# EAGLE design HRD_2016 (EAGLE 7.3.0)

## Sheet 1 of 3
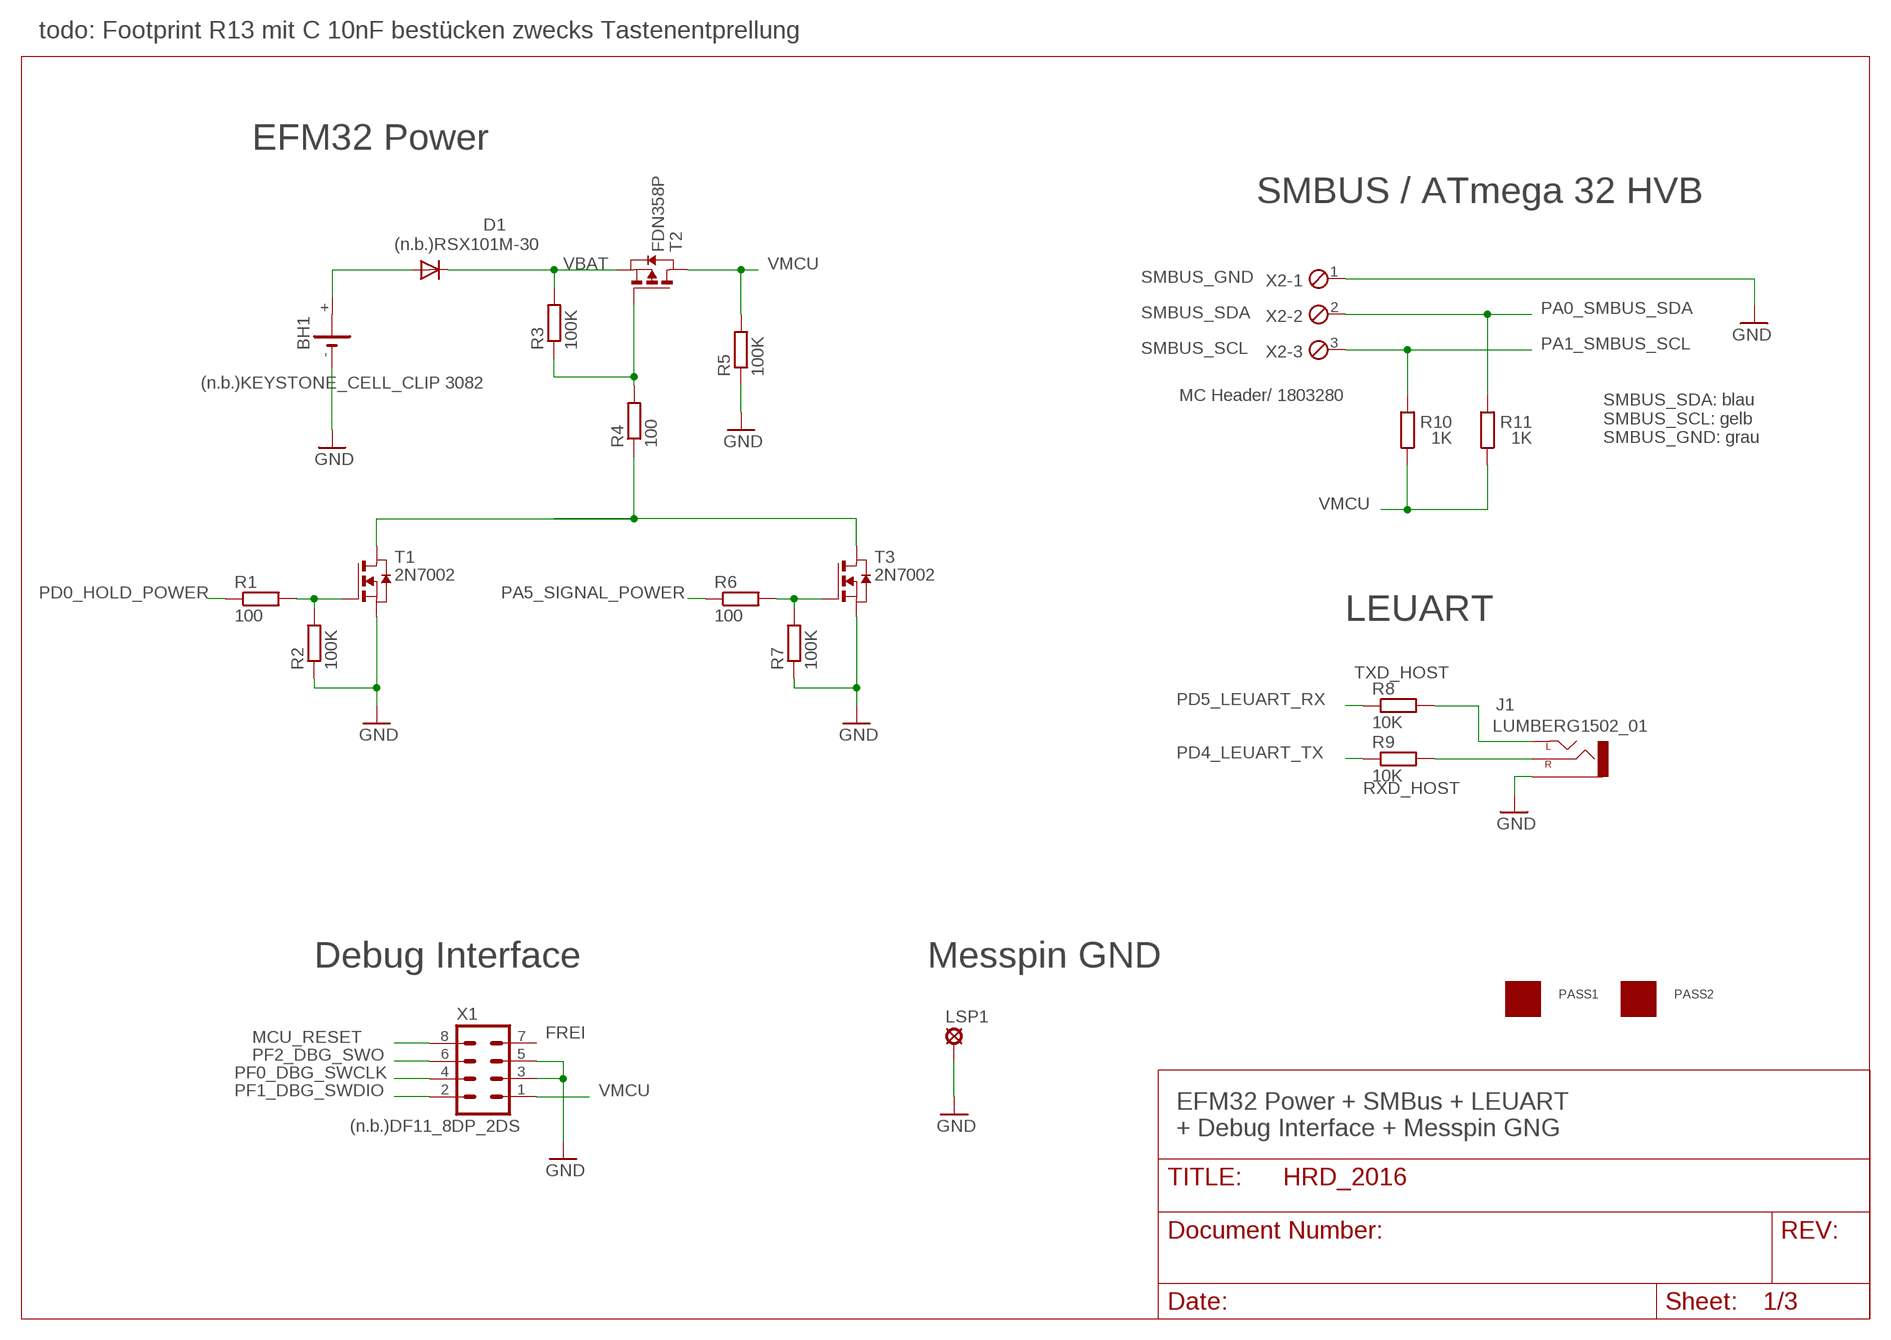
[diagram p0: schematic, sheet 1]

### Parts
BH1  (n.b.)KEYSTONE_CELL_CLIP 3082  3082  [3082]
D1  (n.b.)RSX101M-30  DIODE-SOD123  [SOD123]
J1  LUMBERG1502_01  [LUMBERG1502_01]
LSP1  (n.b.)LSP13  LSP13  [LSP13]
PASS1  ROUND_1MM1.5  [ROUND2_1.5MM]
PASS2  ROUND_1MM1.5  [ROUND2_1.5MM]
R1  100  R-EU_R0805  [R0805]
R2  100K  R-EU_R0805  [R0805]
R3  100K  R-EU_R0805  [R0805]
R4  100  R-EU_R0805  [R0805]
R5  100K  R-EU_R0805  [R0805]
R6  100  R-EU_R0805  [R0805]
R7  100K  R-EU_R0805  [R0805]
R8  10K  R-EU_R0805  [R0805]
R9  10K  R-EU_R0805  [R0805]
R10  1K  R-EU_R0805  [R0805]
R11  1K  R-EU_R0805  [R0805]
T1  2N7002  NMOSSOT23  [SOT-23]
T2  FDN358P  ZETEX_PMOSSOT23  [ZETEX_SOT-23]
T3  2N7002  NMOSSOT23  [SOT-23]
X1  (n.b.)DF11_8DP_2DS  DP11_8DP_2DS  [DP11_8DP-2DS]
X2  MC Header/ 1803280  MKDS1/3-3,81  [3POL381]

### Nets
GND: BH1.- J1.P$1(1-SLEEVE) LSP1.MP R2.1 R5.1 R7.1 T1.2(S) T3.2(S) X1.3 X1.5 X2.1 ; also sheet 2,3
MCU_RESET: X1.8 ; also sheet 2
N$1: BH1.+ D1.A
N$5: R1.2 R2.2 T1.3(G)
N$7: R4.1 T1.1(D) T3.1(D)
N$8: R6.2 R7.2 T3.3(G)
N$21: R3.1 R4.2 T2.3(G)
PA0_SMBUS_SDA: R11.2 X2.2 ; also sheet 2
PA1_SMBUS_SCL: R10.2 X2.3 ; also sheet 2
PA5_SIGNAL_POWER: R6.1 ; also sheet 2,3
PD0_HOLD_POWER: R1.1 ; also sheet 2
PD4_LEUART_TX: R9.1 ; also sheet 2
PD5_LEUART_RX: R8.1 ; also sheet 2
PF0_DBG_SWCLK: X1.4 ; also sheet 2
PF1_DBG_SWDIO: X1.2 ; also sheet 2
PF2_DBG_SWO: X1.6 ; also sheet 2
RXD_HOST: J1.P$3(3-RIGHT) R9.2
TXD_HOST: J1.P$2(2-LEFT) R8.2
VBAT: D1.C R3.2 T2.2(S) ; also sheet 3
VMCU: R5.2 R10.1 R11.1 T2.1(D) X1.1 ; also sheet 2,3
Unconnected: BH1.+1(+) X1.7

### Notes on the sheet
- todo: Footprint R13 mit C 10nF bestücken zwecks Tastenentprellung
- EFM32 Power
- SMBUS / ATmega 32 HVB
- SMBUS_GND
- SMBUS_SDA
- SMBUS_SCL
- SMBUS_SDA: blau
  SMBUS_SCL: gelb
  SMBUS_GND: grau
- LEUART
- Debug Interface | Messpin GND
- FREI
- EFM32 Power + SMBus + LEUART
  + Debug Interface + Messpin GNG

## Sheet 2 of 3
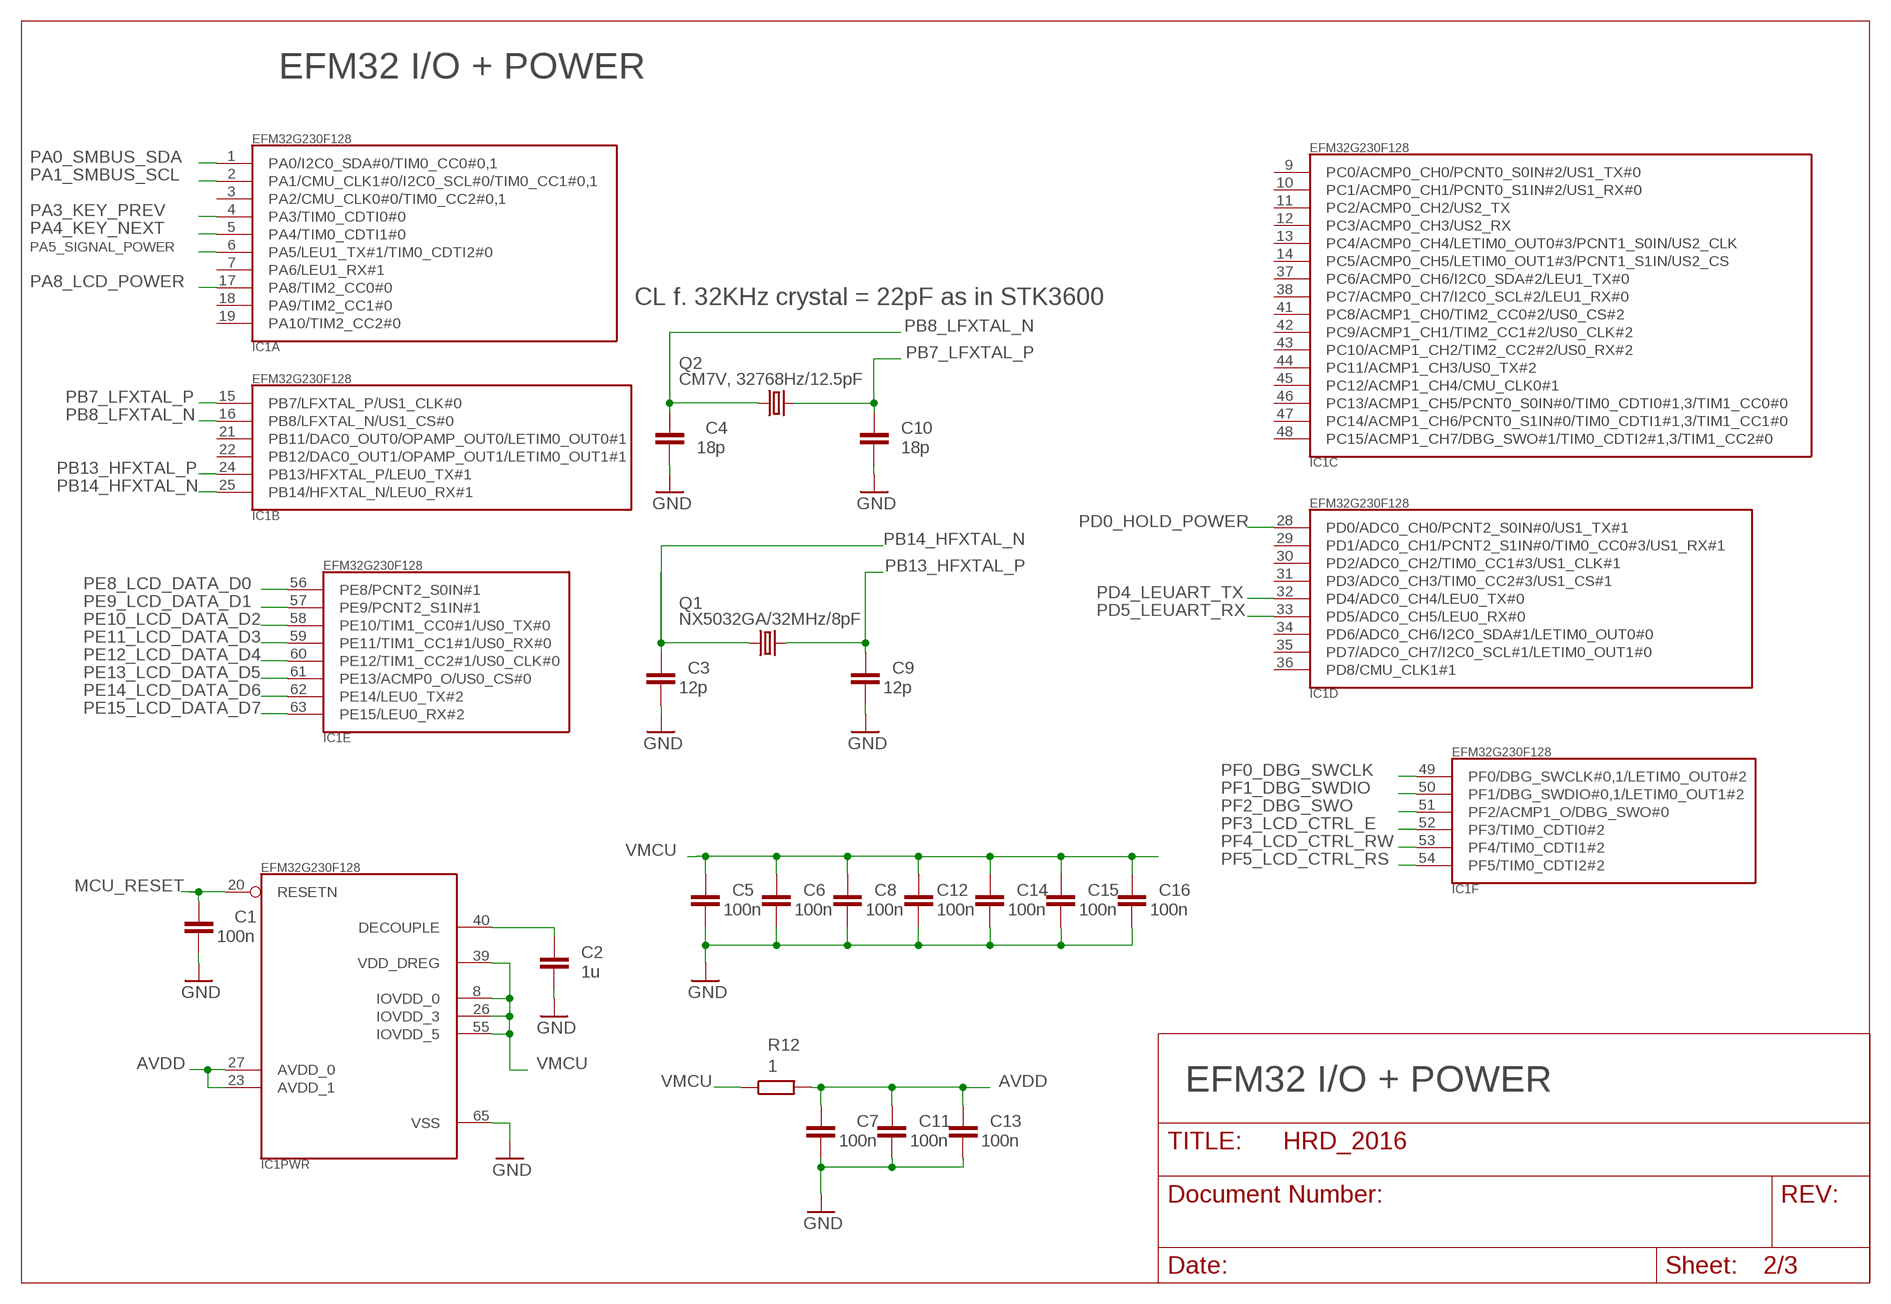
[diagram p1: schematic, sheet 2]

### Parts
C1  100n  C-EUC0805K  [C0805K]
C2  1u  C-EUC0805K  [C0805K]
C3  12p  C-EUC0805K  [C0805K]
C4  18p  C-EUC0805K  [C0805K]
C5  100n  C-EUC0805K  [C0805K]
C6  100n  C-EUC0805K  [C0805K]
C7  100n  C-EUC0805K  [C0805K]
C8  100n  C-EUC0805K  [C0805K]
C9  12p  C-EUC0805K  [C0805K]
C10  18p  C-EUC0805K  [C0805K]
C11  100n  C-EUC0805K  [C0805K]
C12  100n  C-EUC0805K  [C0805K]
C13  100n  C-EUC0805K  [C0805K]
C14  100n  C-EUC0805K  [C0805K]
C15  100n  C-EUC0805K  [C0805K]
C16  100n  C-EUC0805K  [C0805K]
IC1  EFM32G230F128  [QFN64]
Q1  NX5032GA/32MHz/8pF  CRYSTAL2P5.0X3.2  [CRYSTAL2P5.0X3.2]
Q2  CM7V, 32768Hz/12.5pF  CRYSTAL2P  [CRYSTAL2P3.2X1.5]
R12  1  R-EU_R0805  [R0805]

### Nets
AVDD [VCC]: C7.2 C11.2 C13.2 IC1.23(PWR:AVDD_1) IC1.27(PWR:AVDD_0) R12.2
GND: C1.1 C2.1 C3.1 C4.1 C5.1 C6.1 C7.1 C8.1 C9.1 C10.1 C11.1 C12.1 C13.1 C14.1 C15.1 C16.1 IC1.65(PWR:VSS) ; also sheet 1,3
MCU_RESET: C1.2 IC1.20(PWR:RESETN) ; also sheet 1
N$30: C2.2 IC1.40(PWR:DECOUPLE)
PA0_SMBUS_SDA: IC1.1(A:PA0/I2C0_SDA#0/TIM0_CC0#0,1) ; also sheet 1
PA1_SMBUS_SCL: IC1.2(A:PA1/CMU_CLK1#0/I2C0_SCL#0/TIM0_CC1#0,1) ; also sheet 1
PA3_KEY_PREV: IC1.4(A:PA3/TIM0_CDTI0#0) ; also sheet 3
PA4_KEY_NEXT: IC1.5(A:PA4/TIM0_CDTI1#0) ; also sheet 3
PA5_SIGNAL_POWER: IC1.6(A:PA5/LEU1_TX#1/TIM0_CDTI2#0) ; also sheet 1,3
PA8_LCD_POWER: IC1.17(A:PA8/TIM2_CC0#0) ; also sheet 3
PB7_LFXTAL_P: C10.2 IC1.15(B:PB7/LFXTAL_P/US1_CLK#0) Q2.2
PB8_LFXTAL_N: C4.2 IC1.16(B:PB8/LFXTAL_N/US1_CS#0) Q2.1
PB13_HFXTAL_P: C9.2 IC1.24(B:PB13/HFXTAL_P/LEU0_TX#1) Q1.2
PB14_HFXTAL_N: C3.2 IC1.25(B:PB14/HFXTAL_N/LEU0_RX#1) Q1.1
PD0_HOLD_POWER: IC1.28(D:PD0/ADC0_CH0/PCNT2_S0IN#0/US1_TX#1) ; also sheet 1
PD4_LEUART_TX: IC1.32(D:PD4/ADC0_CH4/LEU0_TX#0) ; also sheet 1
PD5_LEUART_RX: IC1.33(D:PD5/ADC0_CH5/LEU0_RX#0) ; also sheet 1
PE8_LCD_DATA_D0: IC1.56(E:PE8/PCNT2_S0IN#1) ; also sheet 3
PE9_LCD_DATA_D1: IC1.57(E:PE9/PCNT2_S1IN#1) ; also sheet 3
PE10_LCD_DATA_D2: IC1.58(E:PE10/TIM1_CC0#1/US0_TX#0) ; also sheet 3
PE11_LCD_DATA_D3: IC1.59(E:PE11/TIM1_CC1#1/US0_RX#0) ; also sheet 3
PE12_LCD_DATA_D4: IC1.60(E:PE12/TIM1_CC2#1/US0_CLK#0) ; also sheet 3
PE13_LCD_DATA_D5: IC1.61(E:PE13/ACMP0_O/US0_CS#0) ; also sheet 3
PE14_LCD_DATA_D6: IC1.62(E:PE14/LEU0_TX#2) ; also sheet 3
PE15_LCD_DATA_D7: IC1.63(E:PE15/LEU0_RX#2) ; also sheet 3
PF0_DBG_SWCLK: IC1.49(F:PF0/DBG_SWCLK#0,1/LETIM0_OUT0#2) ; also sheet 1
PF1_DBG_SWDIO: IC1.50(F:PF1/DBG_SWDIO#0,1/LETIM0_OUT1#2) ; also sheet 1
PF2_DBG_SWO: IC1.51(F:PF2/ACMP1_O/DBG_SWO#0) ; also sheet 1
PF3_LCD_CTRL_E: IC1.52(F:PF3/TIM0_CDTI0#2) ; also sheet 3
PF4_LCD_CTRL_RW: IC1.53(F:PF4/TIM0_CDTI1#2) ; also sheet 3
PF5_LCD_CTRL_RS: IC1.54(F:PF5/TIM0_CDTI2#2) ; also sheet 3
VMCU: C5.2 C6.2 C8.2 C12.2 C14.2 C15.2 C16.2 IC1.8(PWR:IOVDD_0) IC1.26(PWR:IOVDD_3) IC1.39(PWR:VDD_DREG) IC1.55(PWR:IOVDD_5) R12.1 ; also sheet 1,3
Unconnected: IC1.3(A:PA2/CMU_CLK0#0/TIM0_CC2#0,1) IC1.7(A:PA6/LEU1_RX#1) IC1.9(C:PC0/ACMP0_CH0/PCNT0_S0IN#2/US1_TX#0) IC1.10(C:PC1/ACMP0_CH1/PCNT0_S1IN#2/US1_RX#0) IC1.11(C:PC2/ACMP0_CH2/US2_TX) IC1.12(C:PC3/ACMP0_CH3/US2_RX) IC1.13(C:PC4/ACMP0_CH4/LETIM0_OUT0#3/PCNT1_S0IN/US2_CLK) IC1.14(C:PC5/ACMP0_CH5/LETIM0_OUT1#3/PCNT1_S1IN/US2_CS) IC1.18(A:PA9/TIM2_CC1#0) IC1.19(A:PA10/TIM2_CC2#0) IC1.21(B:PB11/DAC0_OUT0/OPAMP_OUT0/LETIM0_OUT0#1) IC1.22(B:PB12/DAC0_OUT1/OPAMP_OUT1/LETIM0_OUT1#1) IC1.29(D:PD1/ADC0_CH1/PCNT2_S1IN#0/TIM0_CC0#3/US1_RX#1) IC1.30(D:PD2/ADC0_CH2/TIM0_CC1#3/US1_CLK#1) IC1.31(D:PD3/ADC0_CH3/TIM0_CC2#3/US1_CS#1) IC1.34(D:PD6/ADC0_CH6/I2C0_SDA#1/LETIM0_OUT0#0) IC1.35(D:PD7/ADC0_CH7/I2C0_SCL#1/LETIM0_OUT1#0) IC1.36(D:PD8/CMU_CLK1#1) IC1.37(C:PC6/ACMP0_CH6/I2C0_SDA#2/LEU1_TX#0) IC1.38(C:PC7/ACMP0_CH7/I2C0_SCL#2/LEU1_RX#0) IC1.41(C:PC8/ACMP1_CH0/TIM2_CC0#2/US0_CS#2) IC1.42(C:PC9/ACMP1_CH1/TIM2_CC1#2/US0_CLK#2) IC1.43(C:PC10/ACMP1_CH2/TIM2_CC2#2/US0_RX#2) IC1.44(C:PC11/ACMP1_CH3/US0_TX#2) IC1.45(C:PC12/ACMP1_CH4/CMU_CLK0#1) IC1.46(C:PC13/ACMP1_CH5/PCNT0_S0IN#0/TIM0_CDTI0#1,3/TIM1_CC0#0) IC1.47(C:PC14/ACMP1_CH6/PCNT0_S1IN#0/TIM0_CDTI1#1,3/TIM1_CC1#0) IC1.48(C:PC15/ACMP1_CH7/DBG_SWO#1/TIM0_CDTI2#1,3/TIM1_CC2#0)

### Notes on the sheet
- EFM32 I/O + POWER
- CL f. 32KHz crystal = 22pF as in STK3600
- EFM32 I/O + POWER

## Sheet 3 of 3
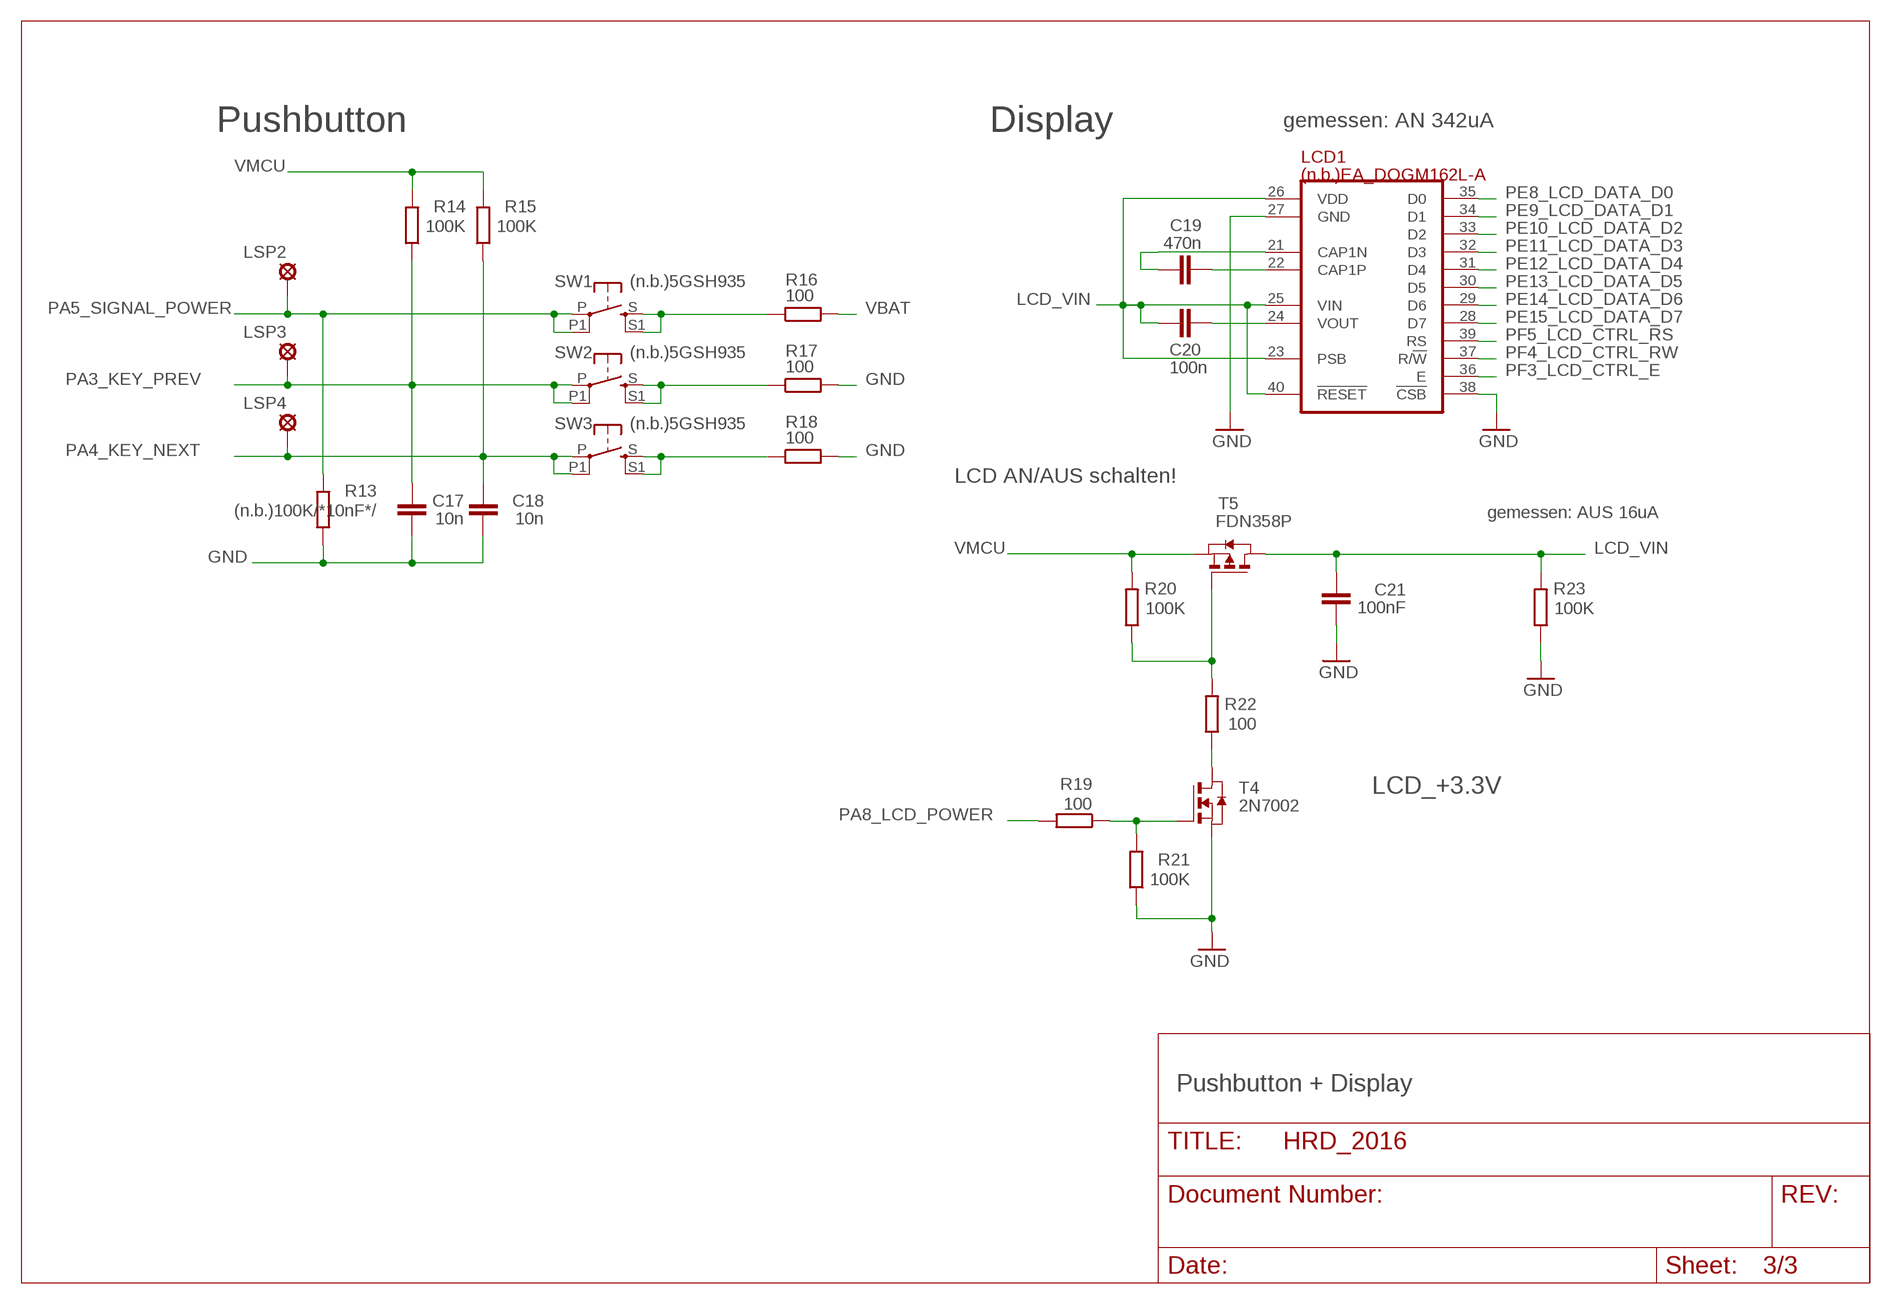
[diagram p2: schematic, sheet 3]

### Parts
C17  10n  C-EUC0603K  [C0603K]
C18  10n  C-EUC0603K  [C0603K]
C19  470n  C-EUC0603K  [C0603K]
C20  100n  C-EUC0603K  [C0603K]
C21  100nF  C-EUC0603K  [C0603K]
LCD1  (n.b.)EA_DOGM162L-A  EA_DOGM162  [EA_DOGM]
LSP2  (n.b.)SE13  SE13  [SE13]
LSP3  (n.b.)SE13  SE13  [SE13]
LSP4  (n.b.)SE13  SE13  [SE13]
R13  (n.b.)100K/*10nF*/  R-EU_R0805  [R0805]
R14  100K  R-EU_R0805  [R0805]
R15  100K  R-EU_R0805  [R0805]
R16  100  R-EU_R0805  [R0805]
R17  100  R-EU_R0805  [R0805]
R18  100  R-EU_R0805  [R0805]
R19  100  R-EU_R0805  [R0805]
R20  100K  R-EU_R0805  [R0805]
R21  100K  R-EU_R0805  [R0805]
R22  100  R-EU_R0805  [R0805]
R23  100K  R-EU_R0805  [R0805]
SW1  (n.b.)5GSH935  5GSH935  [MULTIMEC_5GSH935]
SW2  (n.b.)5GSH935  5GSH935  [MULTIMEC_5GSH935]
SW3  (n.b.)5GSH935  5GSH935  [MULTIMEC_5GSH935]
T4  2N7002  ZETEX_NMOSSOT23  [ZETEX_SOT-23]
T5  FDN358P  ZETEX_PMOSSOT23  [ZETEX_SOT-23]

### Nets
GND: C17.1 C18.1 C21.2 LCD1.27(GND) LCD1.38(!CSB!) R13.1 R17.2 R18.2 R21.1 R23.1 T4.2(S) ; also sheet 1,2
LCD_VIN: C20.2 C21.1 LCD1.23(PSB) LCD1.25(VIN) LCD1.26(VDD) LCD1.40(!RESET!) R23.2 T5.1(D)
N$2: R17.1 SW2.S SW2.S1
N$3: R16.1 SW1.S SW1.S1
N$4: R18.1 SW3.S SW3.S1
N$6: R20.1 R22.2 T5.3(G)
N$10: R22.1 T4.1(D)
N$12: R19.1 R21.2 T4.3(G)
N$25: C19.2 LCD1.22(CAP1P)
N$27: C19.1 LCD1.21(CAP1N)
N$28: C20.1 LCD1.24(VOUT)
PA3_KEY_PREV: C17.2 LSP3.MP R14.1 SW2.P SW2.P1 ; also sheet 2
PA4_KEY_NEXT: C18.2 LSP4.MP R15.1 SW3.P SW3.P1 ; also sheet 2
PA5_SIGNAL_POWER: LSP2.MP R13.2 SW1.P SW1.P1 ; also sheet 1,2
PA8_LCD_POWER: R19.2 ; also sheet 2
PE8_LCD_DATA_D0: LCD1.35(D0) ; also sheet 2
PE9_LCD_DATA_D1: LCD1.34(D1) ; also sheet 2
PE10_LCD_DATA_D2: LCD1.33(D2) ; also sheet 2
PE11_LCD_DATA_D3: LCD1.32(D3) ; also sheet 2
PE12_LCD_DATA_D4: LCD1.31(D4) ; also sheet 2
PE13_LCD_DATA_D5: LCD1.30(D5) ; also sheet 2
PE14_LCD_DATA_D6: LCD1.29(D6) ; also sheet 2
PE15_LCD_DATA_D7: LCD1.28(D7) ; also sheet 2
PF3_LCD_CTRL_E: LCD1.36(E) ; also sheet 2
PF4_LCD_CTRL_RW: LCD1.37(R/!W!) ; also sheet 2
PF5_LCD_CTRL_RS: LCD1.39(RS) ; also sheet 2
VBAT: R16.2 ; also sheet 1
VMCU: R14.2 R15.2 R20.2 T5.2(S) ; also sheet 1,2

### Notes on the sheet
- Pushbutton | Display | gemessen: AN 342uA
- LCD AN/AUS schalten!
- gemessen: AUS 16uA
- LCD_+3.3V
- Pushbutton + Display

## Library data of the parts
BH1 = battery:3082
C1-C21 = rcl:C-EU: CAPACITOR, European symbol
D1 = diode:DIODE-: DIODE
IC1 = EnergyMicro:EFM32G230F128: EFM32G230F128 Gecko Microcontroller in 9mm x 9mm QFN64 package
J1 = EdM 2011:LUMBERG1502_01
LCD1 = ea:EA_DOGM162: ELECTRONIC ASSEMBYL GmbH EA DOGM162-A EA DOGM081-A EA DOGM163-A
LSP1 = solpad:LSP13: SOLDER PAD drill 1.3 mm, distributor Buerklin, 12H562
LSP2-LSP4 = solpad:SE13: SOLDER PAD E1542, drill 1,3mm, distributor Buerklin, 07F815
PASS1 PASS2 = Passermarks:ROUND_1MM
Q1 Q2 = EdM 2011:CRYSTAL2P: Quarz Crystal
R1-R9 R12 = rcl:R-EU_: RESISTOR, European symbol
R10 R11 R13-R23 = resistor:R-EU_: RESISTOR, European symbol
SW1-SW3 = switch-omron_1:5GSH935
T1 T3 = zetex:NMOSSOT23: MOS FET; OC_FARNELL: unknown; OC_NEWARK: unknown
T2 T5 = SESA:ZETEX_PMOSSOT23: MOS FET
T4 = SESA:ZETEX_NMOSSOT23: MOS FET
X1 = con-hirose_1:DP11_8DP_2DS
X2 = con-phoenix-381:MKDS1/3-3,81: MKDS 1/3-3,81 - Order No. 1727023 (RS-Online - 101-5390) Pitch: 3,81mm Number of terminals: 3 Rated Voltage: 160V Maximum load current/ cross section: 12A/1.5mm2-AWG16 Housing Interlocking: none Color: Green

## Net classes
1 GND: width 0.2 mm
2 VCC: width 0.25 mm

## Board
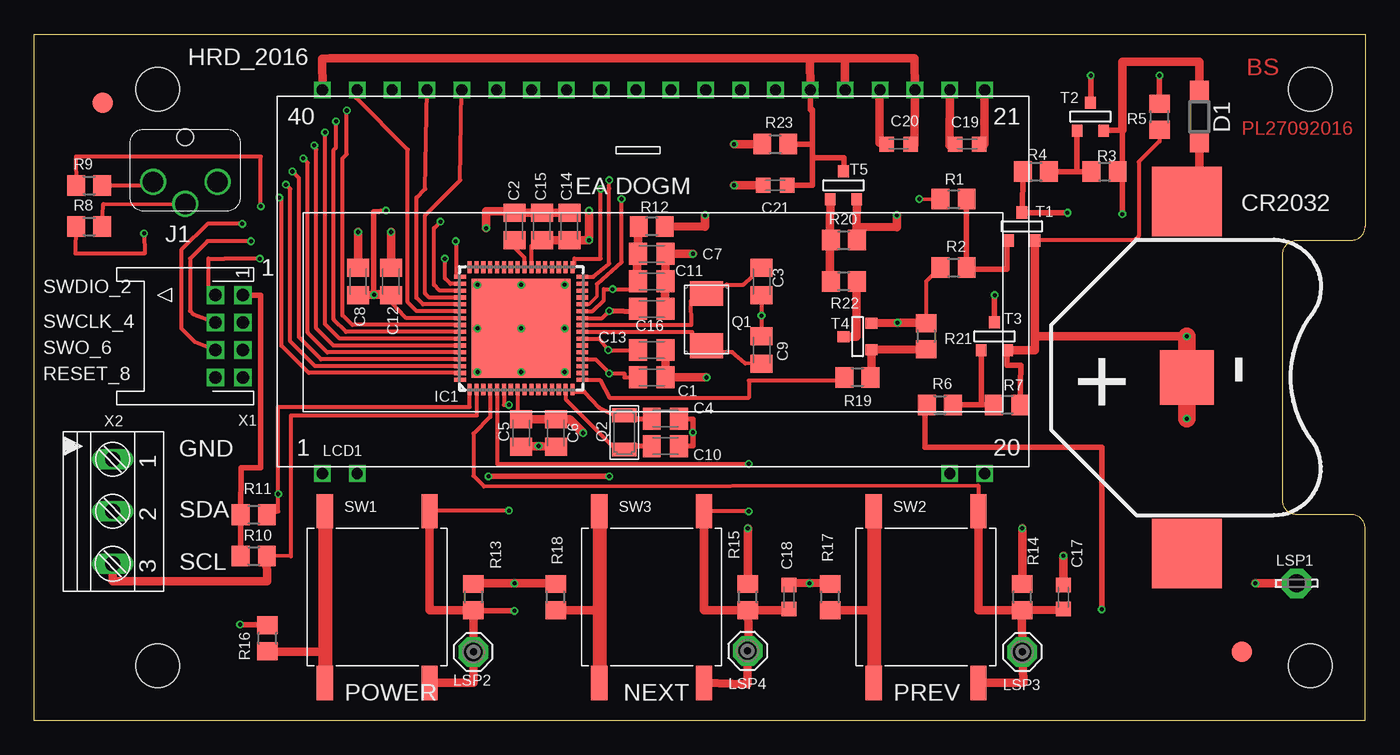
[diagram p3: board, top side]
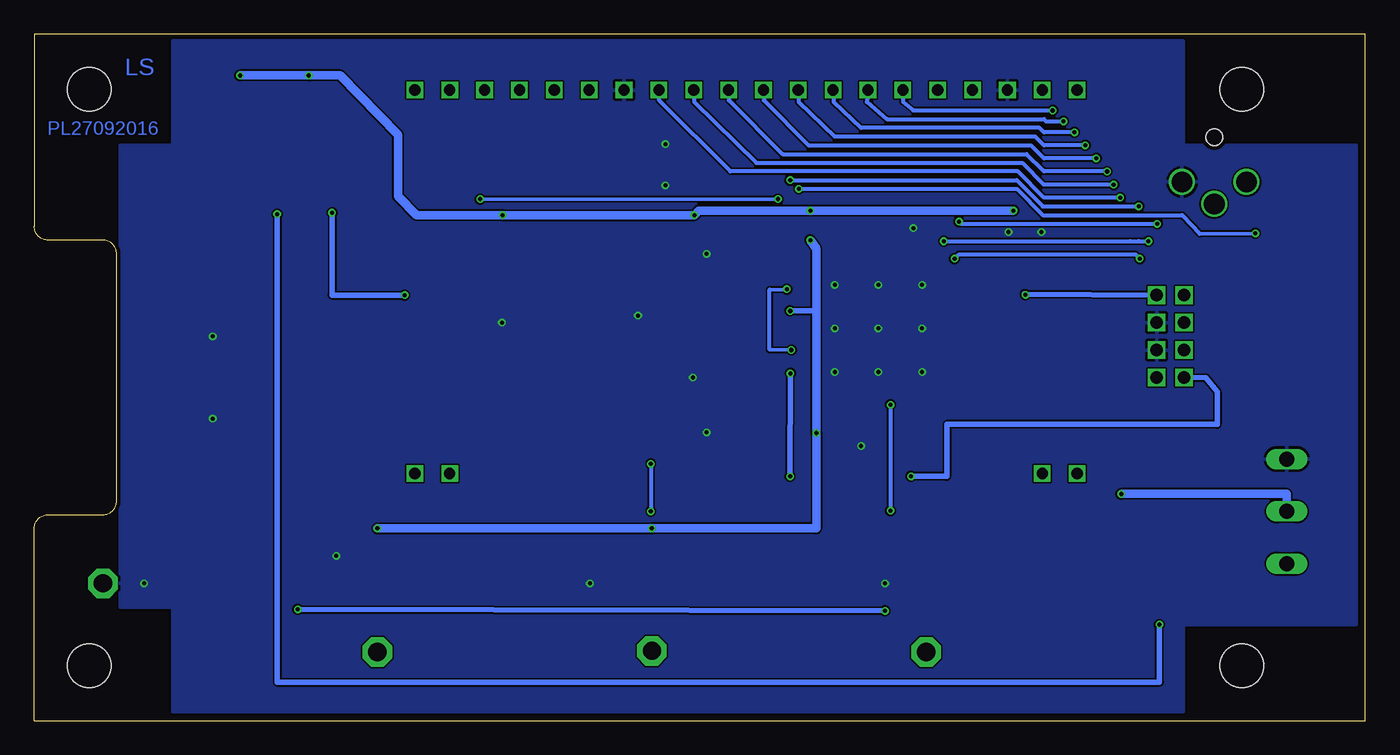
[diagram p4: board, bottom side, seen from below]

Size 97 x 50 mm. Coordinates in mm from the lower left corner, seen from the top.
Outline: 0,0 0,50 97,50 97,36 arc-90 96,35 92,35 arc90 91,34 91,16 arc90 92,15 96,15 arc-90 97,14 97,0 0,0
Copper layers (1*16): Top 0.035mm / dielectric 1.5mm / Bottom 0.035mm
Design rules "PCB-POOL HighSpec *": minimum track width 0.125mm, minimum drill 0.2mm, track to track 0.125mm, track to pad 0.125mm, pad to pad 0.125mm, via to via 0.125mm, smd to smd 0mil, copper to edge 0.3mm, drill to drill 0.2mm, minimum pad ring 0.2mm, minimum via ring 0.125mm, stop-mask expansion 0.075mm, vias tented up to drill 0mil, thermal gap 0.2mm
Holes 3.2 mm at 9,4 93,4 93,46 9,46

### Footprints (pad centres in the part's own frame; a part is rotated, then mirrored left to right if it is on the bottom)
3082 = smd 5.08 x 5.08: + -12.827,0; +1 12.827,0 | smd 3.962 x 3.962: - 0,0
C0805K = smd 1.3 x 1.6: 1 -1,0; 2 1,0
C0603K = smd 1.05 x 1.08: 1 -0.875,0; 2 0.875,0
SOD123 = smd 1.4 x 1.4: A 1.9,0; C -1.9,0
QFN64 = smd 0.85 x 0.3: 1 -4.45,3.75; 2 -4.45,3.25; 3 -4.45,2.75; 4 -4.45,2.25; 5 -4.45,1.75; 6 -4.45,1.25; 7 -4.45,0.75; 8 -4.45,0.25; 9 -4.45,-0.25; 10 -4.45,-0.75; 11 -4.45,-1.25; 12 -4.45,-1.75; 13 -4.45,-2.25; 14 -4.45,-2.75; 15 -4.45,-3.25; 16 -4.45,-3.75; 33 4.45,-3.75; 34 4.45,-3.25; 35 4.45,-2.75; 36 4.45,-2.25; 37 4.45,-1.75; 38 4.45,-1.25; 39 4.45,-0.75; 40 4.45,-0.25; 41 4.45,0.25; 42 4.45,0.75; 43 4.45,1.25; 44 4.45,1.75; 45 4.45,2.25; 46 4.45,2.75; 47 4.45,3.25; 48 4.45,3.75 | smd 0.3 x 0.85: 17 -3.75,-4.45; 18 -3.25,-4.45; 19 -2.75,-4.45; 20 -2.25,-4.45; 21 -1.75,-4.45; 22 -1.25,-4.45; 23 -0.75,-4.45; 24 -0.25,-4.45; 25 0.25,-4.45; 26 0.75,-4.45; 27 1.25,-4.45; 28 1.75,-4.45; 29 2.25,-4.45; 30 2.75,-4.45; 31 3.25,-4.45; 32 3.75,-4.45; 49 3.75,4.45; 50 3.25,4.45; 51 2.75,4.45; 52 2.25,4.45; 53 1.75,4.45; 54 1.25,4.45; 55 0.75,4.45; 56 0.25,4.45; 57 -0.25,4.45; 58 -0.75,4.45; 59 -1.25,4.45; 60 -1.75,4.45; 61 -2.25,4.45; 62 -2.75,4.45; 63 -3.25,4.45; 64 -3.75,4.45 | smd 7.2 x 7.2: 65 0,0
LUMBERG1502_01 = drill 1.5: P$1 -2.35,0.75; P$2 0,2.35; P$3 2.35,0.75 | hole 1.2: 0,-2.5
EA_DOGM = drill 0.813 square: 1 0,0; 2 2.54,0; 19 45.72,0; 20 48.26,0; 21 48.26,27.94; 22 45.72,27.94; 23 43.18,27.94; 24 40.64,27.94; 25 38.1,27.94; 26 35.56,27.94; 27 33.02,27.94; 28 30.48,27.94; 29 27.94,27.94; 30 25.4,27.94; 31 22.86,27.94; 32 20.32,27.94; 33 17.78,27.94; 34 15.24,27.94; 35 12.7,27.94; 36 10.16,27.94; 37 7.62,27.94; 38 5.08,27.94; 39 2.54,27.94; 40 0,27.94
LSP13 = drill 1.321 pad 2.159 octagon: MP 0,0
SE13 = drill 1.321 pad 2.159 octagon: MP 0,0
ROUND2_1.5MM = smd 1.5 x 1.5: FID 0,0
CRYSTAL2P5.0X3.2 = smd 1.8 x 2.4: 1 -1.9,0; 2 1.9,0
CRYSTAL2P3.2X1.5 = smd 1 x 1.8: 1 -1.25,0; 2 1.25,0
R0805 = smd 1.3 x 1.5: 1 -0.95,0; 2 0.95,0
MULTIMEC_5GSH935 = smd 2.5 x 1.2: P -6.25,-3.81; P1 6.249,-3.81; S -6.25,3.81; S1 6.25,3.81
SOT-23 = smd 0.787 x 0.889: 1 0.025,-1.016; 2 -0.94,1.016; 3 0.991,1.016
ZETEX_SOT-23 = smd 0.787 x 0.889: 1 0.025,-1.016; 2 -0.94,1.016; 3 0.991,1.016
DP11_8DP-2DS = drill 0.9 square: 1 3,-9.2; 2 3,-7.2; 3 1,-9.2; 4 1,-7.2; 5 -1,-9.2; 6 -1,-7.2; 7 -3,-9.2; 8 -3,-7.2
3POL381 = drill 1.1 long: 1 0,0; 2 3.81,0; 3 7.62,0

### Placement (x,y rotation side)
BH1  84,25 270 top
C1  45,25 180 top
C2  35,36 270 top
C3  53,32 90 top
C4  46,22 180 top
C5  35.48,20.95 90 top
C6  38.02,20.95 90 top
C7  45,34 180 top
C8  23.6,32 270 top
C9  53,27 270 top
C10  46,20 180 top
C11  45,32 180 top
C12  26,32 270 top
C13  45,27 180 top
C14  39,36 270 top
C15  37,36 270 top
C16  45,30 180 top
C17  75,9 270 top
C18  55,9 270 top
C19  68,42 180 top
C20  63,42 0 top
C21  54,39 180 top
D1  84.9,44 270 top
IC1  35.48,28.57 90 top
J1  11,40 180 top
LCD1  21,18 0 top
LSP1  92,10 0 top
LSP2  32,5 180 top
LSP3  72,5 0 top
LSP4  51.99,5.08 0 top
PASS1  5,45 0 top
PASS2  88,5 0 top
Q1  49,29.21 270 top
Q2  43,21 270 top
R1  67,38 0 top
R2  67,33 0 top
R3  78,40 0 top
R4  73,40 0 top
R5  82,44 90 top
R6  66,23 0 top
R7  70.9,23 180 top
R8  4,36 0 top
R9  4,39 0 top
R10  16,12 0 top
R11  16,15 0 top
R12  45,36 180 top
R13  32,9 270 top
R14  72,9 90 top
R15  52,9 90 top
R16  17,6 90 top
R17  58,9 90 top
R18  38,9 90 top
R19  60,25 180 top
R20  59,35 0 top
R21  65,28 270 top
R22  59,32 180 top
R23  54,42 0 top
SW1  25,9 90 top
SW2  65,9 90 top
SW3  45,9 90 top
T1  72,36 180 top
T2  77,44 180 top
T3  70,28 180 top
T4  60,28 270 top
T5  59,39 180 top
X1  6,28 90 top
X2  5.71,19.05 270 top

### Tracks (layer width: path | path; a pad name or v marks a point on that pad's centre or on a via)
AVDD  (via drill 0.3)
  Top 0.305: C13.2 v41.83,27 41.15,27.82 IC1.23 | IC1.27 40.7,29.82 41.51,30.64 41.51,31.43 v42.15,31.43 44.01,31.43 C11.2
  Top 0.61: C11.2 43.92,32.03 | 43.92,32.03 43.92,32.01 | 43.92,32.03 43.92,33.81 | 43.92,33.81 44.02,34.07 | 44.02,34.07 C7.2 44.08,33.91 43.92,33.81 | 44.02,34.07 44.02,35.66 R12.2
  Bottom 0.305: v41.83,27 43.42,27.03 43.42,31.4 v42.15,31.43
GND  (via drill 0.3)
  Top 0.305: C3.1 v53,29.5 C9.1 | 34.39,37.09 C2.1 | R5.1 82,42.2 81.1,41.3 80.5,40.7 80.5,35.3 80.18,34.98 T1.2 | R2.1 65,31.99 R21.1
  Top 0.406: C4.1 48,21.96 v48,21 48,20.02 C10.1 | T3.2 70.9,26.98 70.9,25.9 71.89,25.9 R7.1
  Top 0.61: C17.1 v75,12 | C18.1 54.95,10.03 v56.5,10 58.29,10.03 R17.2 | R18.2 38.02,9.62 | T4.2 63.41,28.98 v62.92,28.99 65.32,28.99 R21.1 | C8.1 v23.6,35.6 | C12.1 v26,35.6 | C14.1 38.95,37.01 37.21,37.01 36.91,36.85 C15.1 C2.1 34.84,37.01 | C13.1 46.02,26.95 46.02,25.04 C1.1 v49,25 | 45.98,30.42 45.98,29.76 C16.1 46.02,30.16 45.98,30.42 | 46.02,32.07 C11.1 45.87,32.16 46.02,32.13 | 46.02,32.13 46.02,33.97 C7.1 v48,34 | 45.98,30.42 46.02,32.07 | 46.02,32.07 46.02,32.13 | C21.2 v51,39 | R23.1 v51,42 | C5.1 35.16,20 v36.75,20 37.03,20 C6.1 | v32.94,35.88 32.94,36.12 32.92,37.09 34.39,37.09 | LSP1.MP 90.28,10.01 v89,10 | v84,28 72.94,28 | 72.94,28 T1.2 | 38,9.85 R18.2 | R18.2 38,10 v35,10 31.8,10 R13.1 | T3.2 72.94,26.98 72.94,28
  Top 1.27: v84,28 BH1.- v84,22
  other vias: 32.3,31.75 35.48,31.75 38.66,31.75 32.3,25.4 35.48,25.4 38.66,25.4 35.48,28.57 32.3,28.57 38.66,28.57
  pour Bottom: 0.64,41.91 13.26,41.91 13.26,49.53 86.92,49.53 86.92,41.91 90.72,41.91 90.72,8.26 86.92,8.26 86.92,0.64 13.26,0.64 13.26,6.99 0.64,6.99
LCD_VIN
  Top 0.406: 58.89,40.01 59,40.01 59,41 56.7,41 | 56.7,41 56.7,39 C21.1 | R23.2 56.7,42 | 56.7,42 56.7,41 | 56.7,42 56.7,44.5 56.56,44.5 LCD1.26
  Top 0.61: LCD1.40 20.98,48.23 21.51,48.26 56.53,48.26 | LCD1.26 56.53,48.26 | 56.53,48.26 59.08,48.26 | LCD1.25 59.08,48.26 | 59.08,48.26 64.16,48.26 LCD1.23 64.16,41.9 C20.2 | 58.89,40.01 T5.1
MCU_RESET  (via drill 0.3)
  Top 0.305: IC1.20 40.91,26.32 41.83,25.4 v41.9,25.29 43,25.29 43,25 C1.2
  Top 0.406: v33.1,17.8 v41.91,17.8
  Bottom 0.406: X1.8 11.61,24.98 10.79,23.96 10.79,21.59 30.48,21.59 30.49,17.8 v33.1,17.8 | v41.91,17.8 v41.9,25.29
N$1
  Top 0.61: D1.A 84.9,37.7 84,37.7 BH1.+
N$2
  Top 0.61: R17.1 60.88,8.04 61.18,7.94
  Top 1.016: SW2.S1 61.18,7.94 SW2.S
N$3
  Top 0.61: SW1.S 21.1,2.75 21.1,5 17,5 R16.1
  Top 1.016: SW1.S1 SW1.S
N$4
  Top 0.61: R18.1 41.2,8.04 41.2,7.94
  Top 1.016: SW3.S1 41.2,7.94 SW3.S
N$5
  Top 0.406: R1.2 R2.2 67.99,32.9 70.9,32.9 70.9,34.98 T1.3
N$6
  Top 0.61: T5.3 57.98,35.88 | 57.98,35.88 57.98,31.88 R22.2 | R20.1 57.98,35.88
N$7  (via drill 0.3)
  Top 0.406: R4.1 72.01,37.02 T1.1 75.3,37.02 v75.3,37 | v70,31 69.97,30.9 T3.1
  Bottom 0.406: v75.3,37 75.3,31 v70,31
N$8
  Top 0.406: R6.2 R7.2 69.01,23 T3.3
N$10
  Top 0.61: R22.1 59.93,31.84 59.93,27.98 T4.1
N$12
  Top 0.61: R21.2 65.18,27.05 T4.3 61,24.77 R19.1
N$21
  Top 0.406: R3.1 76,40 | 76,40 R4.2 | T2.3 76,40
N$25
  Top 0.61: LCD1.22 66.69,41.9 C19.2
N$27
  Top 0.61: LCD1.21 69.23,42 C19.1
N$28
  Top 0.61: LCD1.24 61.6,45.94 61.6,42.1 62.15,42.1 C20.1
N$30
  Top 0.305: IC1.40 35.73,33.72 34.88,34.57 C2.2
PA0_SMBUS_SDA  (via drill 0.3)
  Top 0.305: R11.2 17.78,15.24 v17.78,16.51 17.78,22.86 31.73,22.86 IC1.1
  Bottom 0.61: X2.2 5.71,16.51 v17.78,16.51
PA1_SMBUS_SCL
  Top 0.305: IC1.2 32.25,24.12 32.25,22.23 18.68,22.23 18.68,11.96 R10.2
  Top 0.61: X2.3 5.71,10.16 16.96,10.16 R10.2
PA3_KEY_PREV
  Top 0.305: IC1.4 33.23,22.13 32,20.9 32,17.84 32.77,17.07 68.8,17.14 SW2.P1
  Top 0.61: R14.1 68.8,8.04 SW2.P1 | R14.1 71.97,7.94 LSP3.MP 72.08,2.74 SW2.P | R14.1 74.97,8.06 C17.2
PA4_KEY_NEXT  (via drill 0.3)
  Top 0.305: IC1.5 33.73,18.7 v52.07,18.7 | v52.07,15.24 SW3.P1
  Top 0.61: SW3.P 51.99,2.64 LSP4.MP 52.07,5.08 R15.1 | R15.1 54.51,8.04 C18.2 | R15.1 48.81,8.04 SW3.P1
  Bottom 0.305: v52.07,18.7 v52.07,15.24
PA5_SIGNAL_POWER  (via drill 0.3)
  Top 0.305: IC1.6 34.23,23 v34.6,23 | v34.6,15.3 28.86,15.3 SW1.P1 | 32,2.75 LSP2.MP
  Top 0.406: R6.1 64.9,23 64.9,19.9 77.8,19.9 v77.8,8.1 | v35,8 31.9,8 R13.2
  Top 0.61: SW1.P 32,2.75 LSP2.MP R13.2 28.81,8.05 28.81,9.95 | 28.81,9.95 28.81,10.1 | 28.81,10.1 SW1.P1 | 28.81,9.95 28.81,10.1
  Bottom 0.305: v34.6,23 v34.6,15.3
  Bottom 0.406: v77.8,8.1 v35,8
PA8_LCD_POWER
  Top 0.305: IC1.17 41.22,24.82 41.91,23.53 52.07,23.53 52.07,24.77 59.05,24.77 R19.2
PB7_LFXTAL_P
  Top 0.305: IC1.15 38.73,23.42 42.33,19.82 43.58,19.82 Q2.2
  Top 0.406: C10.2 43.1,20.02 Q2.2
PB8_LFXTAL_N
  Top 0.305: IC1.16 39.23,23.97 40.08,23.97 41.16,22.8 42.9,21.96
  Top 0.406: C4.2 42.9,21.96 Q2.1
PB13_HFXTAL_P
  Top 0.305: IC1.24 47.94,28.32 48,27.46 48.03,27.46 Q1.2 48.66,26.83 48.97,26.83 49.75,26.85 50.86,26.85 51.8,26.02 C9.2
PB14_HFXTAL_N
  Top 0.305: IC1.25 47.89,28.82 47.84,30.58 48.25,30.58 Q1.1 48.49,31.11 50.45,31.77 51.68,31.77 C3.2
PD0_HOLD_POWER  (via drill 0.3)
  Top 0.254: IC1.28 40.42,30.32 41,30.9 41,31.8 | v64.5,38 R1.1
  Top 0.305: v42.8,38 42.8,33.4 41,31.8
  Bottom 0.254: v42.8,38 v64.5,38
PD4_LEUART_TX  (via drill 0.3)
  Top 0.305: v16.51,37.47 16.51,41.08 3.02,41.08 R9.1 | IC1.32 40.73,32.33 41.9,33.3 41.9,38.78 v41.91,39.37
  Bottom 0.305: v41.91,39.37 25.4,39.37 23.5,37.47 v16.51,37.47
PD5_LEUART_RX  (via drill 0.3)
  Top 0.305: IC1.33 39.37,33.02 39.37,33.66 41.27,33.66 v41.27,38.73 | v8,35.5 8.04,34.02 3.01,34.02 R8.1
  Bottom 0.305: v41.27,38.73 25.4,38.73 23.5,36.83 13.34,36.83 12.06,35.46 v8,35.5
PE8_LCD_DATA_D0  (via drill 0.3)
  Top 0.305: v22.78,44.45 22.78,41.27 22.46,40.96 22.46,29.53 23.16,28.82 IC1.56
  Bottom 0.305: LCD1.35 33.67,45.09 32.94,44.45 v22.78,44.45
PE9_LCD_DATA_D1  (via drill 0.3)
  Top 0.305: v21.99,43.66 21.99,41.75 21.83,41.59 21.83,29.21 22.71,28.32 IC1.57
  Bottom 0.305: LCD1.34 36.31,45.09 34.84,43.81 23.41,43.81 23.26,43.66 v21.99,43.66
PE10_LCD_DATA_D2  (via drill 0.3)
  Top 0.305: v21.19,42.86 21.19,28.89 22.26,27.82 IC1.58
  Bottom 0.305: LCD1.33 38.76,45.09 36.75,43.18 23.73,43.18 23.41,42.86 v21.19,42.86
PE11_LCD_DATA_D3  (via drill 0.3)
  Top 0.305: v20.4,41.91 20.56,41.59 20.56,28.57 21.81,27.32 IC1.59
  Bottom 0.305: LCD1.32 41.3,45.09 38.66,42.55 24.05,42.55 23.41,41.91 v20.4,41.91
PE12_LCD_DATA_D4  (via drill 0.3)
  Top 0.305: v19.61,40.96 19.92,40.64 19.92,28.26 21.36,26.82 IC1.60
  Bottom 0.305: LCD1.31 43.84,45.19 40.56,41.91 24.37,41.91 23.41,40.96 v19.61,40.96
PE13_LCD_DATA_D5  (via drill 0.3)
  Top 0.305: v18.81,40.01 19.29,39.53 19.29,27.94 20.9,26.32 IC1.61
  Bottom 0.305: LCD1.30 46.38,45.19 42.47,41.27 24.68,41.27 23.41,40.01 v18.81,40.01
PE14_LCD_DATA_D6  (via drill 0.3)
  Top 0.305: v18.34,39.05 18.65,38.73 18.65,27.62 20.45,25.82 IC1.62
  Bottom 0.305: LCD1.29 48.91,45.09 44.37,40.64 25,40.64 23.41,39.05 v18.34,39.05
PE15_LCD_DATA_D7  (via drill 0.3)
  Top 0.305: v17.86,38.1 18.02,37.94 18.02,27.3 20,25.32 IC1.63
  Bottom 0.305: v17.86,38.1 23.41,38.1 25.32,40.01 46.27,40.01 51.45,45.19 LCD1.28
PF0_DBG_SWCLK  (via drill 0.3)
  Top 0.305: IC1.49 30.78,32.33 30.78,34.87 v30.72,34.92 | v15.79,34.92 12.62,34.92 11.35,33.66 11.35,29.84 11.62,29.57 X1.4
  Bottom 0.305: v30.72,34.92 17.14,34.92 arc-5 16.51,34.92 v15.79,34.92
PF1_DBG_SWDIO  (via drill 0.3)
  Top 0.305: IC1.50 30.32,31.82 29.92,32.23 v29.92,33.66 | v16.43,33.66 13.89,33.66 12.7,33.66 12.7,31.57 X1.2
  Bottom 0.305: v29.92,33.66 29.61,33.97 16.75,33.97 v16.43,33.66
PF2_DBG_SWO  (via drill 0.3)
  Top 0.305: IC1.51 29.55,31.32 29.13,31.75 29.13,35.88 v29.61,36.35 | v15.16,36.2 12.62,36.2 10.71,34.29 10.71,28.57 11.71,27.57 X1.6
  Bottom 0.305: v29.61,36.35 29.45,36.2 v15.16,36.2
PF3_LCD_CTRL_E
  Top 0.305: IC1.52 28.79,30.82 28.5,31.11 28.5,36.83 31.04,39.37 LCD1.36
PF4_LCD_CTRL_RW
  Top 0.305: LCD1.37 28.5,38.73 27.86,38.1 27.86,30.8 28.33,30.32 IC1.53
PF5_LCD_CTRL_RS
  Top 0.305: IC1.54 27.88,29.82 27.23,30.48 27.23,41.59 23.41,45.4 LCD1.39
RXD_HOST
  Top 0.305: R9.2 8.48,39.01 J1.P$3
TXD_HOST
  Top 0.305: R8.2 5.03,37.63 J1.P$2
VBAT  (via drill 0.3)
  Top 0.406: T2.2 77.94,43 79.3,43 79.3,40 | 79.3,40 R3.2 79.3,40 | 79.3,40 v79.3,36.9 | v15,7 17,7 R16.2
  Top 0.61: 79.3,43 79.3,48 84.9,48 D1.C
  Bottom 0.406: v79.3,36.9 79.3,2.8 15,2.8 v15,7
VMCU  (via drill 0.3)
  Top 0.305: IC1.55 27.11,29.32 26.43,30 26,30.5 C12.2 | IC1.39 36.23,34.57 37,34.57 C15.2 | IC1.8 35.23,22.01 35.23,21.95 C5.2 | IC1.26 41.39,29.32 v41.91,29.84 | 24.64,31.06 24.77,31.06 v24.77,31.02 | C14.2 39.1,35.01
  Top 0.406: 24.74,31.08 24.74,37.09 v25.64,37.15 | v24.77,31.02 24.77,31.06 | X1.1 16.51,30.98 16.51,18.41 15.06,18.41 R11.1 R10.1 | C16.2 44.05,29.78 v41.91,29.84 | T2.1 77,45.02 v77,47 | v82,47 R5.2
  Top 0.61: T5.2 59.91,35.97 | 59.91,35.97 R20.2 | 46.02,35.88 R12.1 48.9,35.99 v48.9,36.83 | 25.6,31.06 24.64,31.06 24.74,31.08 | 38.89,35.01 39.1,35.01 v40.44,35.01 v40.44,37.15 | C14.2 C15.2 | C5.2 C6.2 39.01,21.95 v40.01,20.95 | v52,14 R15.2 | R14.2 v72,14 | 59.91,35.97 62.87,35.95 v62.87,36.83 | C8.2 v24.77,31.01 | C12.2 v24.77,31.01 | v24.77,31.01 v24.77,31.02
  Bottom 0.305: 24.68,31.07 24.77,31.07 v24.77,31.02 | 76.9,47 v77,47
  Bottom 0.406: X1.1 24.68,31.07 24.84,31.11 | v41.91,29.84 40.01,29.84
  Bottom 0.61: v25.64,37.15 v40.44,37.15 48.58,37.15 v48.9,36.83 v62.87,36.83 69.13,36.83 70.5,38.2 70.5,42.7 74.7,47 76.9,47 | v40.44,35.01 40.01,34.37 40.01,29.84 v40.01,20.95 40.01,14 v52,14 v72,14 | v77,47 v82,47

### Text on the board
Top: BS | PL27092016
Bottom: LS | PL27092016
tNames: HRD_2016 | CR2032 | 1 | SWDIO_2 | SWCLK_4 | SWO_6 | RESET_8 | GND | SDA | SCL | POWER | NEXT | PREV